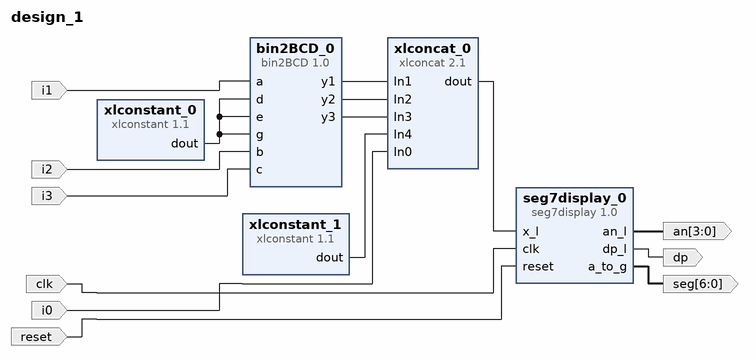
[diagram p0: block diagram of the top level]
# Vivado block design design_1, xc7a35tcpg236-1, Vivado 2023.1
create_bd_design design_1

create_bd_port -dir I i0
create_bd_port -dir I i1
create_bd_port -dir I i2
create_bd_port -dir I i3
create_bd_port -dir I reset
create_bd_port -dir I clk
create_bd_port -dir O -from 6 -to 0 seg
create_bd_port -dir O -from 3 -to 0 an
create_bd_port -dir O dp

create_bd_cell -type ip -vlnv xilinx.com:ip:xlconstant:1.1 xlconstant_0
set_property -dict {CONFIG.CONST_VAL 0} [get_bd_cells xlconstant_0]
create_bd_cell -type ip -vlnv xilinx.com:ip:xlconstant:1.1 xlconstant_1
set_property -dict {CONFIG.CONST_VAL 0 CONFIG.CONST_WIDTH 12} [get_bd_cells xlconstant_1]
create_bd_cell -type ip -vlnv xilinx.com:XUP:bin2BCD:1.0 bin2BCD_0
create_bd_cell -type ip -vlnv xilinx.com:ip:xlconcat:2.1 xlconcat_0
set_property -dict {CONFIG.IN4_WIDTH 12 CONFIG.NUM_PORTS 5} [get_bd_cells xlconcat_0]
create_bd_cell -type ip -vlnv xilinx.com:XUP:seg7display:1.0 seg7display_0

# ---- connections ----

connect_bd_net [get_bd_pins bin2BCD_0/y1] [get_bd_pins xlconcat_0/In1]
connect_bd_net [get_bd_pins bin2BCD_0/y2] [get_bd_pins xlconcat_0/In2]
connect_bd_net [get_bd_pins bin2BCD_0/y3] [get_bd_pins xlconcat_0/In3]
connect_bd_net [get_bd_ports clk] [get_bd_pins seg7display_0/clk]
connect_bd_net -net i0_1 [get_bd_ports i0] [get_bd_pins xlconcat_0/In0]
connect_bd_net -net i1_1 [get_bd_ports i1] [get_bd_pins bin2BCD_0/a]
connect_bd_net -net i2_1 [get_bd_ports i2] [get_bd_pins bin2BCD_0/b]
connect_bd_net -net i3_1 [get_bd_ports i3] [get_bd_pins bin2BCD_0/c]
connect_bd_net [get_bd_ports reset] [get_bd_pins seg7display_0/reset]
connect_bd_net [get_bd_pins seg7display_0/a_to_g] [get_bd_ports seg]
connect_bd_net [get_bd_pins seg7display_0/an_l] [get_bd_ports an]
connect_bd_net [get_bd_pins seg7display_0/dp_l] [get_bd_ports dp]
connect_bd_net [get_bd_pins xlconcat_0/dout] [get_bd_pins seg7display_0/x_l]
connect_bd_net [get_bd_pins xlconstant_0/dout] [get_bd_pins bin2BCD_0/g] [get_bd_pins bin2BCD_0/e] [get_bd_pins bin2BCD_0/d]
connect_bd_net [get_bd_pins xlconstant_1/dout] [get_bd_pins xlconcat_0/In4]

validate_bd_design
save_bd_design
